# Altium schematic sheet ETH.SchDoc
size A4; SheetNumber: 5; SheetTotal: 6
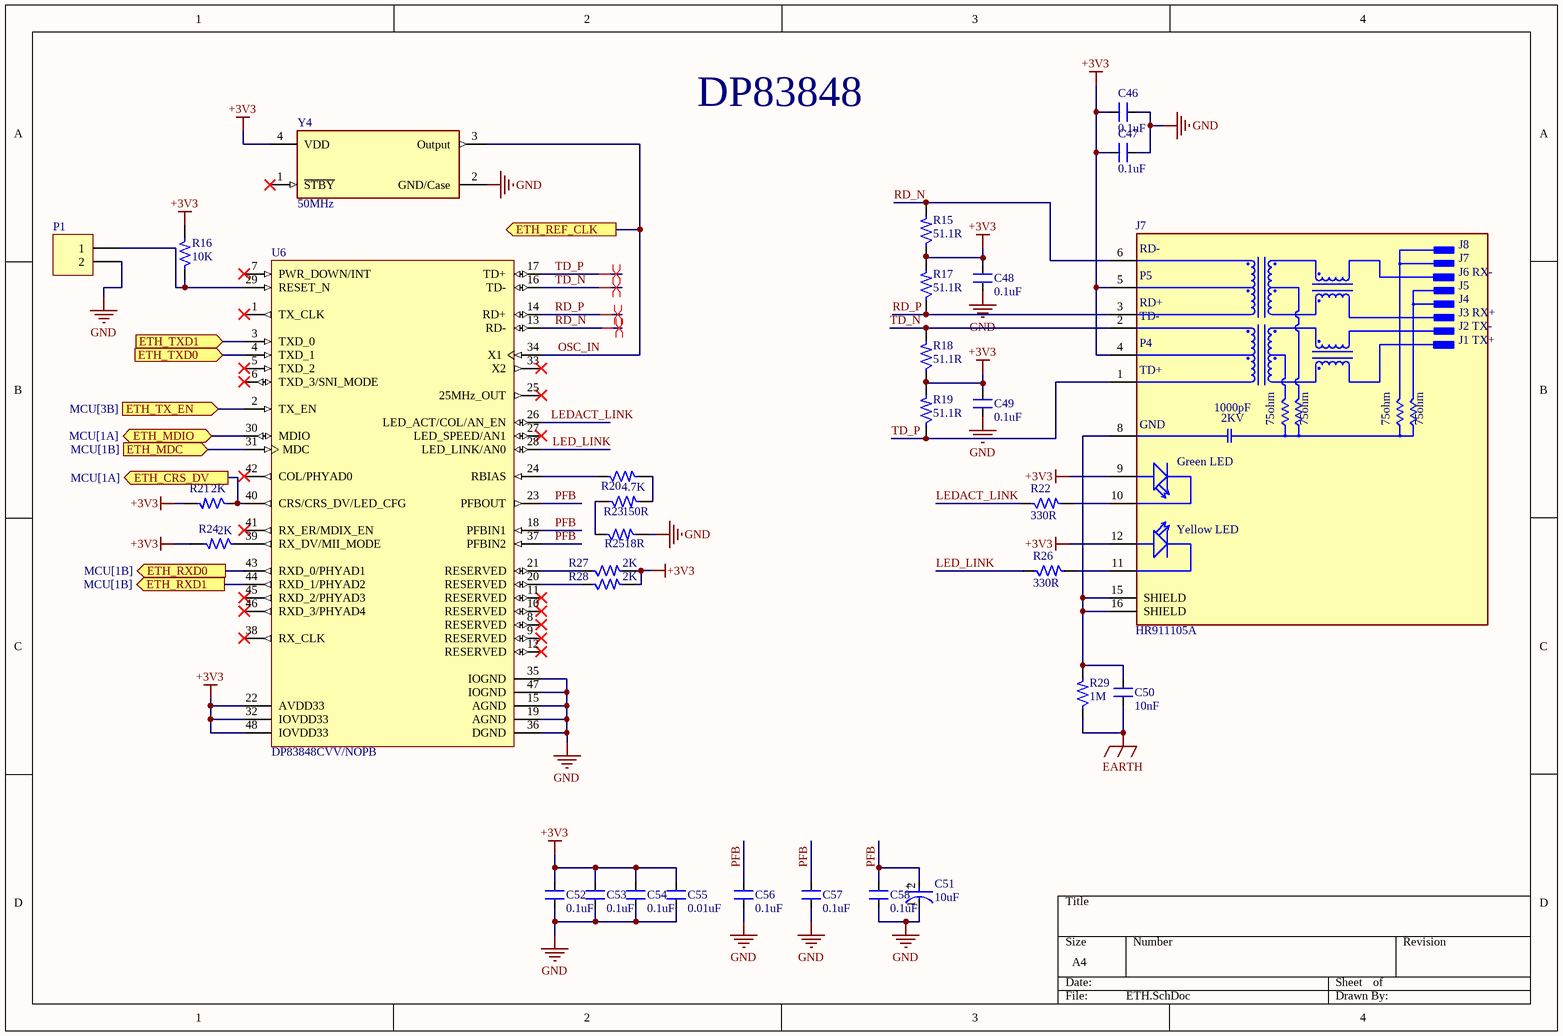
[diagram p0: ETH.SchDoc]

## Parts
C46  0.1uF  [CAP_0805]
C47  0.1uF  [CAP_0805]
C48  0.1uF  [CAP_0805]
C49  0.1uF  [CAP_0805]
C50  10nF  [CAP_P196_102X287_H332_RAD_TH]
C51  10uF  [FP-293DA-MFG]
C52  0.1uF  [CAP_0805]
C53  0.1uF  [CAP_0805]
C54  0.1uF  [CAP_0805]
C55  0.01uF  [CAP_0805]
C56  0.1uF  [CAP_0805]
C57  0.1uF  [CAP_0805]
C58  0.1uF  [CAP_0805]
J7  HR911105A  [HANRUN_HR911105A]
P1  BERSTICK 2.5MM, MALE  [CON2_100_43D62_TH_ST]  (value not drawn)
R15  51.1R  [RES_0603]
R16  10K  [RES_0805]
R17  51.1R  [RES_0603]
R18  51.1R  [RES_0603]
R19  51.1R  [RES_0603]
R20  4.7K  [RES_0805]
R21  2K  [RES_0805]
R22  330R  [RES_0805]
R23  150R  [RES_0805]
R24  2K  [RES_0805]
R25  18R  [RES_0805]
R26  330R  [RES_0805]
R27  2K  [RES_0805]
R28  2K  [RES_0805]
R29  1M  [RES_1206]
U6  DP83848CVV/NOPB  [PT0048A_M]
Y4  50MHz  [FP-ASE-MFG]

## Ports
ETH_CRS_DV (out, see MCU[1A]), ETH_MDC (in, see MCU[1B]), ETH_MDIO (bidir, see MCU[1A]), ETH_REF_CLK (out, see MCU[1A]), ETH_RXD0 (out, see MCU[1B]), ETH_RXD1 (out, see MCU[1B]), ETH_TX_EN (in, see MCU[3B]), ETH_TXD0 (in, see MCU[2A]), ETH_TXD1 (in, see MCU[3C])

## Nets
+3V3: C46.1 C47.1 C48.2 C49.2 C52.1 C53.1 C54.2 C55.2 J7.4(P4) J7.5(P5) J7.9(GA) J7.12(YA) R15.1 R16.2 R17.2 R18.1 R19.2 R21.2 R24.2 R27.2 R28.2 U6.22(AVDD33) U6.32(IOVDD33) U6.48(IOVDD33) Y4.4(VDD)
EARTH: C50.1 R29.1
GND: C46.2 C47.2 C48.1 C49.1 C51.1(C) C52.2 C53.2 C54.1 C55.1 C56.2 C57.2 C58.1 P1.2 R25.2 U6.15(AGND) U6.19(AGND) U6.35(IOGND) U6.36(DGND) U6.47(IOGND) Y4.2(GND/Case)
ETH_CRS_DV: R21.1 U6.40(CRS/CRS_DV/LED_CFG) ; port ETH_CRS_DV
ETH_MDC: U6.31(MDC) ; port ETH_MDC
ETH_MDIO: U6.30(MDIO) ; port ETH_MDIO
ETH_RXD0: U6.43(RXD_0/PHYAD1) ; port ETH_RXD0
ETH_RXD1: U6.44(RXD_1/PHYAD2) ; port ETH_RXD1
ETH_TX_EN: U6.2(TX_EN) ; port ETH_TX_EN
ETH_TXD0: U6.4(TXD_1) ; port ETH_TXD0
ETH_TXD1: U6.3(TXD_0) ; port ETH_TXD1
LED_LINK: R26.1 U6.28(LED_LINK/AN0)
LEDACT_LINK: R22.1 U6.26(LED_ACT/COL/AN_EN)
OSC_IN: U6.34(X1) Y4.3(Output) ; port ETH_REF_CLK
PFB: C51.2(A) C56.1 C57.1 C58.2 U6.18(PFBIN1) U6.23(PFBOUT) U6.37(PFBIN2)
RD_N: J7.6(RD-) R15.2 U6.13(RD-)
RD_P: J7.3(RD+) R17.1 U6.14(RD+)
TD_N: J7.2(TD-) R18.2 U6.16(TD-)
TD_P: J7.1(TD+) R19.1 U6.17(TD+)
NetC50_2: C50.2 J7.8(GND) J7.15(SHIELD) J7.16(SHIELD) R29.2
NetJ7_10: J7.10(GC) R22.2
NetJ7_11: J7.11(YC) R26.2
NetP1_1: P1.1 R16.1 U6.29(RESET_N)
NetR20_1: R20.1 U6.24(RBIAS)
NetR20_2: R20.2 R23.2
NetR23_1: R23.1 R25.1
NetR24_1: R24.1 U6.39(RX_DV/MII_MODE)
NetR27_1: R27.1 U6.21(RESERVED)
NetR28_1: R28.1 U6.20(RESERVED)

Not connected (* = marked no-connect by the designer): U6 1(TX_CLK)* 5(TXD_2)* 6(TXD_3/SNI_MODE)* 7(PWR_DOWN/INT)* 8(RESERVED)* 9(RESERVED)* 10(RESERVED)* 11(RESERVED)* 12(RESERVED)* 25(25MHz_OUT)* 27(LED_SPEED/AN1)* 33(X2)* 38(RX_CLK)* 41(RX_ER/MDIX_EN)* 42(COL/PHYAD0)* 45(RXD_2/PHYAD3)* 46(RXD_3/PHYAD4)*; Y4 1(~{STBY})*

## Layout directives
differential pair: RD_N, RD_P, TD_N, TD_P

## Notes on the sheet
- DP83848
- (in symbol CMP-00030-40940187-1) +
- (in symbol HR911105A) J8; J6 RX-; J5; J4; J3 RX+; J2 TX-; J1 TX+; 1000pF; 2KV; 75ohm; Green LED; Yellow LED

## Library data of the parts
C46-C49 C52-C58 = CAP_0.1uF-50V-20%-0805: 0.1µF ±20% 50V Ceramic Capacitor X7R 0805 (2012 Metric); Manufacturer: Samsung Electro-Mechanics; Manufacturer Part Number: CL21B104MBCNNNC; Alternate Part Number-1: NA; Case/Package: 0805; Supplier-1: SIRICOM; Supplier Part Number-1: 0805B104K500CT
C50 = CAP_10nF-1KV-10%-RAD-TH: 10000pF ±10% 1000V (1kV) Ceramic Capacitor X7R Radial; Manufacturer: Yageo; Manufacturer Part Number: RDER73A103K2K1H03B; Alternate Part Number-1: NA; Case/Package: TH; Supplier-1: SP ROAD; Supplier Part Number-1: RDER73A103K2K1H03B
C51 = CMP-00030-40940187-1: 293D105X0016A2TE3 Surface Mount Tantalum Capacitor, 1 uF, 16 V, ± 20%, -55 °C, 125 °C, 1206 [3216-18 Metric]; Ripple Current: 90mA; Capacitance: 1µF; Leakage Current: 500nA; Polarity: Polar; Voltage Rating (DC): 16V; Dissipation Factor: 4%; ESR (Equivalent Series Resistance): 9.3Ω; Case Code (Imperial): 1206; Case/Package: 1206; Schedule B: 8532210050, 8532210050; Height: 1.8mm; Mount: PCB, Surface Mount; Height - Seated (Max): 1.8034mm; Min Operating Temperature: -55°C; Max Operating Temperature: 125°C; Dielectric Material: Tantalum; Packaging: Tape and Reel; Radiation Hardening: No; Lead Free: Lead Free; Features: General Purpose; REACH SVHC: Unknown; Width: 1.6002mm; RoHS: Compliant; Tolerance: 20%; Termination: SMD/SMT; Length: 3.2mm; Depth: 1.6mm; Number of Pins: 2; Voltage Rating: 16V; NexarPartId: 40940187; Case Code (Metric): 3216
J7 = HR911105A: DIP RJ45 Connector;; MF: hanrun; SnapEDA_Link: https://www.snapeda.com/parts/HR911105A/HanRun/view-part/?ref=snap; Package: None; MP: HR911105A; Check_prices: https://www.snapeda.com/parts/HR911105A/HanRun/view-part/?ref=eda; Price: None; Value: *; Availability: Not in stock
P1 = CON-BS-PLG_2X1-100-ST-TH: 2 Pins, 1 Row 2.54mm Pitch, Straight bergstrip, Male; Manufacturer Part Number: NA; Manufacturer: Samtec; Case/Package: TH-CON; Supplier-1: SP ROAD; Supplier Part Number-1: NA; Alternate Part Number-1: NA
R15 R17-R19 = RES_51.1R-0.1W-1%-0603: 51.1 Ohms ±1% 0.1W, 1/10W Chip Resistor 0603 (1608 Metric) Thick Film; Manufacturer: Vishay Dale; Manufacturer Part Number: CRCW060351R1FKEAC; Alternate Part Number-1: NA; Case/Package: 0603; Supplier-1: Digikey; Supplier Part Number-1: 541-5468-1-ND - Cut Tape (CT)
R16 = RES_10K-0.125W-1%-0805: 10 kOhms ±1% 0.125W, 1/8W Chip Resistor 0805 (2012 Metric) Automotive AEC-Q200 Thick Film; Manufacturer: CTS; Manufacturer Part Number: WR08X1002FTL; Case/Package: 0805; Supplier-1: SIRICOM; Supplier Part Number-1: WR08X1002FTL; Alternate Part Number-1: WR08X1002FTL
R20 = RES_4.7K-0.125W-1%-0805: 4.7 kOhms ±1% 0.125W, 1/8W Chip Resistor 0805 (2012 Metric) Moisture Resistant Thick Film; Manufacturer: TE Connectivity; Manufacturer Part Number: RC0805FR-074K7L; Alternate Part Number-1: 0805W8F4701T5E; Case/Package: 0805; Supplier-1: SIRICOM; Supplier Part Number-1: WR08X4701FTL
R21 R24 R27 R28 = RES_2K-0.125W-1%-0805: 2 kOhms ±1% 0.125W, 1/8W Chip Resistor 0805 (2012 Metric) Moisture Resistant Thick Film; Manufacturer: TE Connectivity; Manufacturer Part Number: RC0805FR-072KL; Alternate Part Number-1: NA; Case/Package: 0805; Supplier-1: SIRICOM; Supplier Part Number-1: WR08X2001FTL
R22 R26 = RES_330R-0.125W-1%-0805: 330 Ohms ±1% 0.125W, 1/8W Chip Resistor 0805 (2012 Metric) Automotive AEC-Q200 Thick Film; Manufacturer: Walsin; Manufacturer Part Number: WR08X3300FTL; Alternate Part Number-1: NA; Case/Package: 0805; Supplier-1: SIRICOM; Supplier Part Number-1: WR08X3300FTL
R23 = RES_150R-0.125W-1%-0805: 150 Ohms ±1% 0.125W, 1/8W Chip Resistor 0805 (2012 Metric) Automotive AEC-Q200 Thick Film; Manufacturer: Walsin; Manufacturer Part Number: WR08X1500FTL; Alternate Part Number-1: NA; Case/Package: 0805; Supplier-1: SIRICOM; Supplier Part Number-1: WR12X1500FTL
R25 = RES_18.7K-0.125W-1%-0805: 18.7 kOhms ±1% 0.125W, 1/8W Chip Resistor 0805 (2012 Metric) Automotive AEC-Q200 Thick Film; Manufacturer: Yageo; Manufacturer Part Number: RMCF0805FT18K7; Alternate Part Number-1: NA; Case/Package: 0805; Supplier-1: SIRICOM; Supplier Part Number-1: WR08X1872FTL
R29 = RES_1M-0.25W-1%-1206: 1 MOhms ±1% 0.25W, 1/4W Chip Resistor 1206 (3216 Metric) Automotive AEC-Q200, High Voltage Thick Film; Manufacturer: Walsin; Manufacturer Part Number: WR12X1004FTL; Alternate Part Number-1: NA; Case/Package: 1206; Supplier-1: SIRICOM; Supplier Part Number-1: WR12X1004FTL
U6 = CMP-0058-00766-4: PHYTER® Commercial Temperature Single Port 10/100 Mb/s Ethernet Physical Layer Transceiver, 48-pin LQFP, Pb-Free, 250 Tray; Manufacturer: Texas Instruments; CompType: Interface IC; PowerWise: N; PackageTopMarking: NSUZXYTT*DP83848VV*VBC; High-Reliability: Y; PartNumber: DP83848CVV/NOPB; RoHS: Y; PackageDescription: LQFP, 7 x 7 x 1.4mm, 48 Lead, 0.5mm Pitch; ComponentLink1Description: Datasheet URL; ComponentLink1URL: http://www.ti.com/general/docs/lit/getliterature.tsp?genericPartNumber=DP83848C&fileType=pdf; PinCount: 48; PackageReference: PT0048A
Y4 = CMP-27762-004169-1: XTAL Oscillator 50MHz ±25ppm CMOS 3.3V 4-SMD 3.2mm x 2.5mm; Max Supply Voltage: 3.465V; Min Supply Voltage: 3.135V; Max Supply Current: 19mA; Load Capacitance: 15pF; Width: 0.098inch; Min Operating Temperature: -40°C; Number of Pins: 4; Frequency: 50MHz; Case/Package: SMD/SMT; REACH SVHC: No SVHC; Height: 0.047inch; Frequency Stability: 25ppm; Mount: Surface Mount; Package Quantity: 1000; Operating Supply Voltage: 3.3V; Max Operating Temperature: 85°C; Packaging: Tape and Reel; Length: 0.126inch; Series: ASE